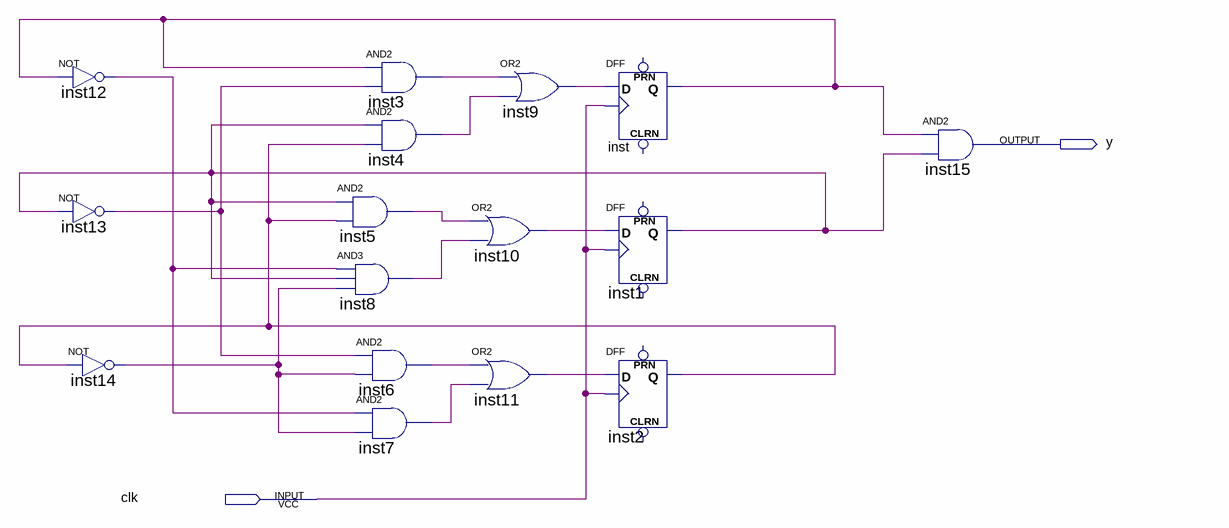
[diagram p0: schematic sheet]
// Quartus schematic 7Xdec.bdf as structural Verilog: 16 symbols, 2 pins
module \7Xdec  (
  input  clk,
  output y
);

  wire inst1_q, inst2_q, inst3_out, inst4_out, inst5_out, inst6_out, inst7_out, inst8_out, inst9_out,
       inst10_out, inst11_out, inst12_out, inst13_out, inst14_out, inst_q;

  not inst12 (inst12_out, inst_q);
  not inst13 (inst13_out, inst1_q);
  not inst14 (inst14_out, inst2_q);
  and inst3 (inst3_out, inst_q, inst13_out);
  and inst4 (inst4_out, inst1_q, inst2_q);
  and inst5 (inst5_out, inst1_q, inst2_q);
  and inst8 (inst8_out, inst12_out, inst1_q, inst14_out);
  and inst6 (inst6_out, inst13_out, inst14_out);
  and inst7 (inst7_out, inst12_out, inst14_out);
  or inst10 (inst10_out, inst5_out, inst8_out);
  or inst11 (inst11_out, inst6_out, inst7_out);
  or inst9 (inst9_out, inst3_out, inst4_out);
  DFF inst (.CLK(clk), .D(inst9_out), .Q(inst_q));  // open: CLRN, PRN
  DFF inst1 (.CLK(clk), .D(inst10_out), .Q(inst1_q));  // open: CLRN, PRN
  DFF inst2 (.CLK(clk), .D(inst11_out), .Q(inst2_q));  // open: CLRN, PRN
  and inst15 (y, inst_q, inst1_q);
endmodule
